# Altium project BMEF01.PrjPcb
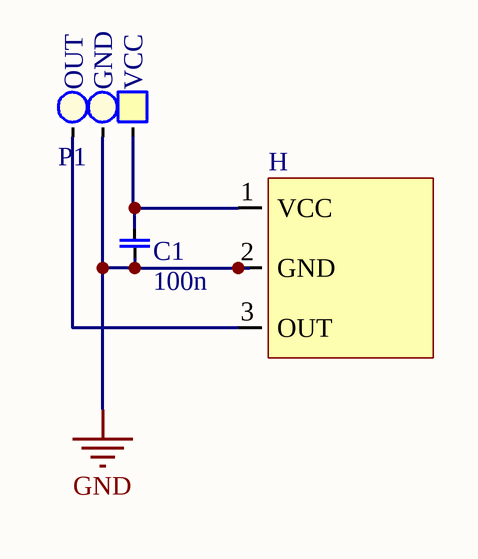
[diagram p0: Halleffektsgivare_kort.SchDoc]
1 sheet, 3 parts. Net scope: global (net labels, ports and power ports of the same name join across sheets).
Board file: Halleffektsgivare_kort.PcbDoc

## Sheet Halleffektsgivare_kort.SchDoc
size A3

### Parts
C1  value 100n  [0402 CAP]  (hidden comment: 0402 capacitor)
H  (no value)  [Allegro A1324]
P1  1x3 Pin Header  [padThree_L]  (value not drawn)

### Nets
GND: C1.1 H.2(GND) P1.2
NetC1_2: C1.2 H.1(VCC) P1.1
NetH_3: H.3(OUT) P1.3

### Notes on the sheet
- (near P1) OUT
- (near P1) GND
- (near P1) VCC

### Library data of the parts
H = ALLEGRO A1324: ALLEGRO A1324, SIP-3
P1 = 1x3 Pin Header: 2.54 mm; Value: 1x3 Pin Header